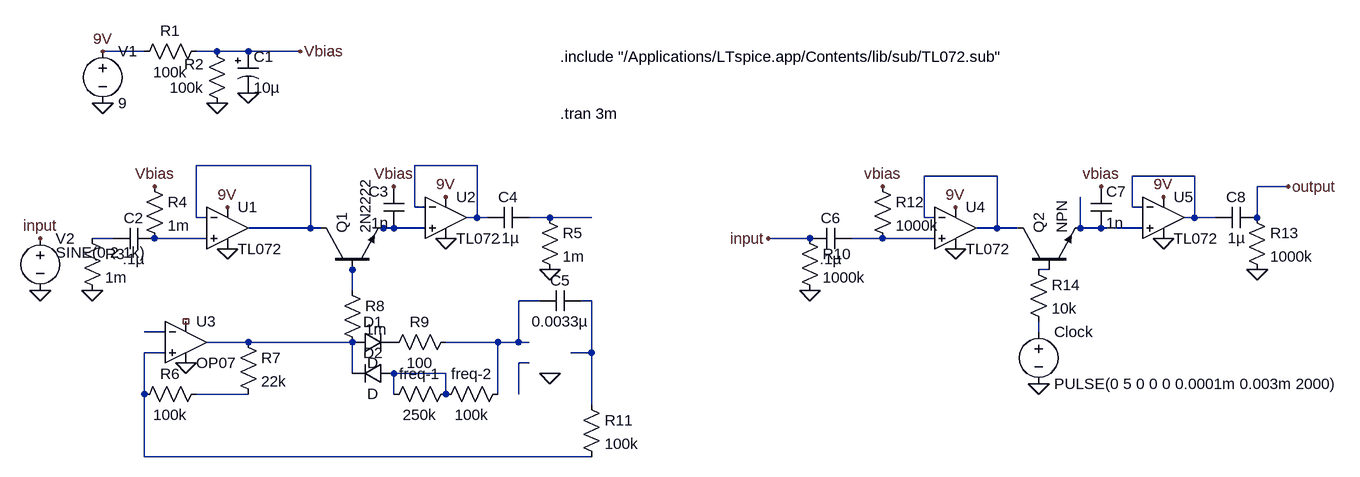
[diagram p0: schematic bitcrusher.asc]
bitcrusher.asc, the LTspice schematic file:
Version 4
SHEET 1 1920 744
WIRE -16 112 -80 112
WIRE 96 112 64 112
WIRE 144 112 96 112
WIRE 224 112 144 112
WIRE 240 288 64 288
WIRE 496 288 400 288
WIRE 1296 304 1184 304
WIRE 1600 304 1504 304
WIRE 1744 320 1696 320
WIRE 400 352 400 288
WIRE 416 352 400 352
WIRE 1504 352 1504 304
WIRE 1520 352 1504 352
WIRE 64 368 64 288
WIRE 80 368 64 368
WIRE 496 368 496 288
WIRE 496 368 480 368
WIRE 512 368 496 368
WIRE 608 368 576 368
WIRE 672 368 608 368
WIRE 1184 368 1184 304
WIRE 1200 368 1184 368
WIRE 1600 368 1600 304
WIRE 1600 368 1584 368
WIRE 1632 368 1600 368
WIRE 1696 368 1696 320
WIRE 240 384 240 288
WIRE 240 384 144 384
WIRE 256 384 240 384
WIRE 352 384 336 384
WIRE 368 384 352 384
WIRE 416 384 368 384
WIRE 1296 384 1296 304
WIRE 1296 384 1264 384
WIRE 1328 384 1296 384
WIRE 1424 384 1424 336
WIRE 1456 384 1424 384
WIRE 1520 384 1456 384
WIRE -64 400 -96 400
WIRE 0 400 -16 400
WIRE 80 400 0 400
WIRE 1008 400 944 400
WIRE 1120 400 1072 400
WIRE 1200 400 1120 400
WIRE 304 448 304 432
WIRE 1376 448 1360 448
WIRE 304 480 304 448
WIRE 592 496 560 496
WIRE 672 496 656 496
WIRE 16 544 -16 544
WIRE 1360 544 1360 528
WIRE 144 560 80 560
WIRE 304 560 144 560
WIRE 528 560 448 560
WIRE 560 560 560 496
WIRE 560 560 528 560
WIRE 576 560 560 560
WIRE 16 576 -16 576
WIRE 672 576 672 496
WIRE 672 576 640 576
WIRE 576 592 560 592
WIRE 304 608 304 560
WIRE 448 608 368 608
WIRE -16 640 -16 576
WIRE 144 640 64 640
WIRE 368 640 368 608
WIRE 448 640 448 608
WIRE 528 640 528 560
WIRE 560 640 560 592
WIRE 672 656 672 576
WIRE -16 736 -16 640
WIRE 672 736 -16 736
FLAG -80 192 0
FLAG -176 480 0
FLAG 224 112 Vbias
FLAG 96 192 0
FLAG 144 176 0
FLAG -96 480 0
FLAG 0 320 Vbias
FLAG 368 320 Vbias
FLAG 448 336 9V
FLAG 112 352 9V
FLAG -80 112 9V
FLAG 608 448 0
FLAG 448 400 0
FLAG 112 416 0
FLAG 608 608 0
FLAG 48 592 0
FLAG 1008 480 0
FLAG 1232 352 9V
FLAG 1232 416 0
FLAG 1552 336 9V
FLAG 1696 448 0
FLAG 1456 320 vbias
FLAG 1120 320 vbias
FLAG -176 400 input
FLAG 944 400 input
FLAG 1744 320 output
FLAG 1360 624 0
FLAG 1552 400 0
SYMBOL voltage -80 96 R0
SYMATTR InstName V1
SYMATTR Value 9
SYMBOL voltage -176 384 R0
WINDOW 3 24 38 Left 2
SYMATTR Value SINE(0 2 1k)
SYMATTR InstName V2
SYMBOL res 80 96 R90
WINDOW 0 0 56 VBottom 2
WINDOW 3 32 56 VTop 2
SYMATTR InstName R1
SYMATTR Value 100k
SYMBOL res 112 208 R180
WINDOW 0 36 76 Left 2
WINDOW 3 36 40 Left 2
SYMATTR InstName R2
SYMATTR Value 100k
SYMBOL polcap 128 112 R0
SYMATTR InstName C1
SYMATTR Value 10µ
SYMBOL res -112 384 R0
SYMATTR InstName R3
SYMATTR Value 1m
SYMBOL res -16 304 R0
SYMATTR InstName R4
SYMATTR Value 1m
SYMBOL res 592 352 R0
SYMATTR InstName R5
SYMATTR Value 1m
SYMBOL Opamps/OP07 48 496 R0
SYMATTR InstName U3
SYMBOL res 80 624 R90
WINDOW 0 0 56 VBottom 2
WINDOW 3 32 56 VTop 2
SYMATTR InstName R6
SYMATTR Value 100k
SYMBOL res 128 544 R0
SYMATTR InstName R7
SYMATTR Value 22k
SYMBOL res 288 464 R0
SYMATTR InstName R8
SYMATTR Value 1m
SYMBOL diode 304 576 R270
WINDOW 0 32 32 VTop 2
WINDOW 3 0 32 VBottom 2
SYMATTR InstName D1
SYMBOL diode 368 592 R90
WINDOW 0 0 32 VBottom 2
WINDOW 3 32 32 VTop 2
SYMATTR InstName D2
SYMBOL res 464 544 R90
WINDOW 0 0 56 VBottom 2
WINDOW 3 32 56 VTop 2
SYMATTR InstName R9
SYMATTR Value 100
SYMBOL res 464 624 R90
WINDOW 0 0 56 VBottom 2
WINDOW 3 32 56 VTop 2
SYMATTR InstName freq-1
SYMATTR Value 250k
SYMBOL res 544 624 R90
WINDOW 0 0 56 VBottom 2
WINDOW 3 32 56 VTop 2
SYMATTR InstName freq-2
SYMATTR Value 100k
SYMBOL res 656 640 R0
SYMATTR InstName R11
SYMATTR Value 100k
SYMBOL cap 0 384 R90
WINDOW 0 0 32 VBottom 2
WINDOW 3 32 32 VTop 2
SYMATTR InstName C2
SYMATTR Value .1µ
SYMBOL cap 384 384 R180
WINDOW 0 24 56 Left 2
WINDOW 3 24 8 Left 2
SYMATTR InstName C3
SYMATTR Value 1n
SYMBOL cap 512 384 R270
WINDOW 0 32 32 VTop 2
WINDOW 3 0 32 VBottom 2
SYMATTR InstName C4
SYMATTR Value .1µ
SYMBOL cap 592 512 R270
WINDOW 0 32 32 VTop 2
WINDOW 3 0 32 VBottom 2
SYMATTR InstName C5
SYMATTR Value 0.0033µ
SYMBOL npn 256 448 R270
SYMATTR InstName Q1
SYMATTR Value 2N2222
SYMBOL Opamps/opamp2 112 320 R0
SYMATTR InstName U1
SYMATTR Value TL072
SYMBOL Opamps/opamp2 448 304 R0
SYMATTR InstName U2
SYMATTR Value TL072
SYMBOL res 992 384 R0
SYMATTR InstName R10
SYMATTR Value 1000k
SYMBOL cap 1072 384 R90
WINDOW 0 0 32 VBottom 2
WINDOW 3 32 32 VTop 2
SYMATTR InstName C6
SYMATTR Value .1µ
SYMBOL res 1104 304 R0
SYMATTR InstName R12
SYMATTR Value 1000k
SYMBOL Opamps/opamp2 1232 320 R0
SYMATTR InstName U4
SYMATTR Value TL072
SYMBOL npn 1328 448 R270
SYMATTR InstName Q2
SYMBOL cap 1440 320 R0
SYMATTR InstName C7
SYMATTR Value 1n
SYMBOL Opamps/opamp2 1552 304 R0
SYMATTR InstName U5
SYMATTR Value TL072
SYMBOL cap 1696 352 R90
WINDOW 0 0 32 VBottom 2
WINDOW 3 32 32 VTop 2
SYMATTR InstName C8
SYMATTR Value 1µ
SYMBOL res 1680 352 R0
SYMATTR InstName R13
SYMATTR Value 1000k
SYMBOL voltage 1360 528 R0
SYMATTR InstName Clock
SYMATTR Value PULSE(0 5 0 0 0 0.0001m 0.003m 2000)
SYMBOL res 1344 432 R0
SYMATTR InstName R14
SYMATTR Value 10k
TEXT 624 208 Left 2 !.tran 3m
TEXT 624 120 Left 2 !.include "/Applications/LTspice.app/Contents/lib/sub/TL072.sub"

The netlist it stands for:
* bitcrusher.asc
V1 9V 0 9
V2 input 0 SINE(0 2 1k)
R1 Vbias 9V 100k
R2 0 Vbias 100k
C1 Vbias 0 10µ
R3 N008 0 1m
R4 Vbias N009 1m
R5 N005 0 1m
XU3 N018 N015 NC_01 0 N017 LT1001  ; OP07, pins In+ In- V+ V- OUT
R6 N021 N018 100k
R7 N017 N021 22k
R8 N011 N017 1m
D1 N017 P001 D
D2 N020 N017 D
R9 N013 P001 100
R§freq-1 N020 N020 250k
R§freq-2 N013 N020 100k
R11 N014 N018 100k
C2 N009 N008 .1µ
C3 N006 Vbias 1n
C4 N002 N005 .1µ
C5 N013 N014 0.0033µ
Q1 N001 N011 N006 0 2N2222
XU1 N009 N001 9V 0 N001 TL072  ; pins In+ In- V+ V- OUT
XU2 N006 N002 9V 0 N002 TL072  ; pins In+ In- V+ V- OUT
R10 input 0 1000k
C6 N010 input .1µ
R12 Vbias N010 1000k
XU4 N010 N003 9V 0 N003 TL072  ; pins In+ In- V+ V- OUT
Q2 N003 N012 N007 0 NPN
C7 Vbias N007 1n
XU5 N007 N004 9V 0 N004 TL072  ; pins In+ In- V+ V- OUT
C8 output N004 1µ
R13 output 0 1000k
V§Clock N016 0 PULSE(0 5 0 0 0 0.0001m 0.003m 2000)
R14 N012 N016 10k
.model D D
.lib standard.dio
.model NPN NPN
.model PNP PNP
.lib standard.bjt
.tran 3m
.include "/Applications/LTspice.app/Contents/lib/sub/TL072.sub"
.lib LTC.lib
.backanno
.end